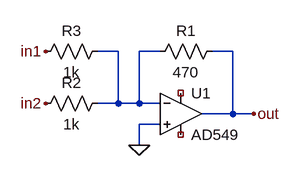
[diagram p0: schematic InvertingAdder.asc]
InvertingAdder.asc, the LTspice schematic file:
Version 4
SHEET 1 880 680
WIRE 192 80 160 80
WIRE 256 80 224 80
WIRE 368 80 336 80
WIRE 192 160 192 80
WIRE 192 160 160 160
WIRE 224 160 224 80
WIRE 224 160 192 160
WIRE 256 160 224 160
WIRE 368 176 368 80
WIRE 368 176 320 176
WIRE 400 176 368 176
WIRE 256 192 224 192
WIRE 224 224 224 192
FLAG 224 224 0
FLAG 80 80 in1
FLAG 80 160 in2
FLAG 400 176 out
SYMBOL Opamps\\AD549 288 112 R0
SYMATTR InstName U1
SYMBOL res 352 64 R90
WINDOW 0 0 56 VBottom 2
WINDOW 3 32 56 VTop 2
SYMATTR InstName R1
SYMATTR Value 470
SYMBOL res 176 144 R90
WINDOW 0 0 56 VBottom 2
WINDOW 3 32 56 VTop 2
SYMATTR InstName R2
SYMATTR Value 1k
SYMBOL res 176 64 R90
WINDOW 0 0 56 VBottom 2
WINDOW 3 32 56 VTop 2
SYMATTR InstName R3
SYMATTR Value 1k

The netlist it stands for:
* InvertingAdder.asc
XU1 0 N001 NC_01 NC_02 out AD549  ; pins In+ In- V+ V- OUT
R1 out N001 470
R2 N001 in2 1k
R3 N001 in1 1k
.backanno
.end